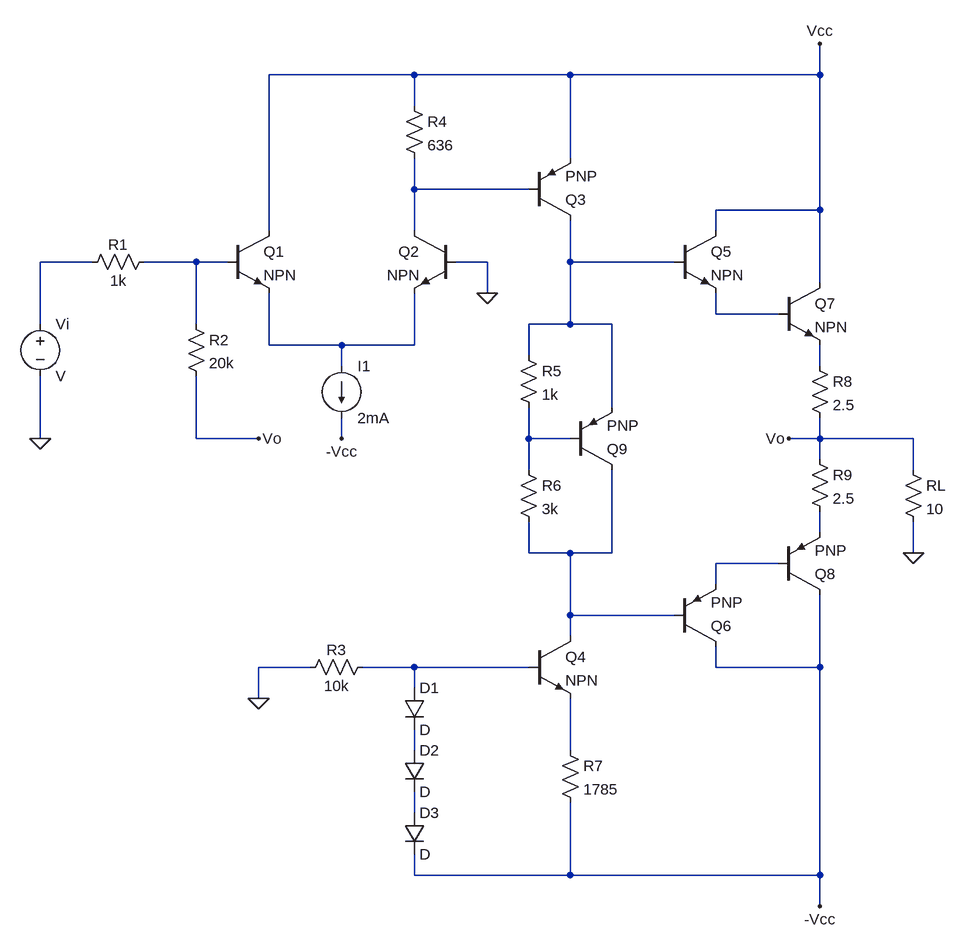
[diagram p0: schematic Ej 3-6.asc]
Ej 3-6.asc, the LTspice schematic file:
Version 4
SHEET 1 1208 1104
WIRE 384 -272 160 -272
WIRE 624 -272 384 -272
WIRE 1008 -272 1008 -320
WIRE 1008 -272 624 -272
WIRE 384 -224 384 -272
WIRE 624 -144 624 -272
WIRE 384 -96 384 -144
WIRE 560 -96 384 -96
WIRE 1008 -64 1008 -272
WIRE 1008 -64 848 -64
WIRE 160 -32 160 -272
WIRE 384 -32 384 -96
WIRE 848 -32 848 -64
WIRE -112 16 -192 16
WIRE 48 16 -32 16
WIRE 96 16 48 16
WIRE 496 16 448 16
WIRE 624 16 624 -48
WIRE 784 16 624 16
WIRE 1008 48 1008 -64
WIRE 496 64 496 16
WIRE 848 96 848 64
WIRE 944 96 848 96
WIRE -192 112 -192 16
WIRE 48 112 48 16
WIRE 624 112 624 16
WIRE 624 112 560 112
WIRE 688 112 624 112
WIRE 160 144 160 64
WIRE 272 144 160 144
WIRE 384 144 384 64
WIRE 384 144 272 144
WIRE 560 160 560 112
WIRE 272 176 272 144
WIRE 1008 176 1008 144
WIRE 688 240 688 112
WIRE -192 288 -192 192
WIRE 48 288 48 192
WIRE 144 288 48 288
WIRE 272 288 272 256
WIRE 560 288 560 240
WIRE 624 288 560 288
WIRE 1008 288 1008 256
WIRE 1008 288 960 288
WIRE 1152 288 1008 288
WIRE 1008 320 1008 288
WIRE 560 336 560 288
WIRE 1152 336 1152 288
WIRE 1008 432 1008 400
WIRE 560 464 560 416
WIRE 624 464 560 464
WIRE 688 464 688 336
WIRE 688 464 624 464
WIRE 1152 464 1152 416
WIRE 944 480 848 480
WIRE 848 512 848 480
WIRE 624 560 624 464
WIRE 784 560 624 560
WIRE 624 592 624 560
WIRE 224 640 144 640
WIRE 384 640 304 640
WIRE 560 640 384 640
WIRE 848 640 848 608
WIRE 1008 640 1008 528
WIRE 1008 640 848 640
WIRE 384 672 384 640
WIRE 144 688 144 640
WIRE 384 768 384 736
WIRE 624 768 624 688
WIRE 384 864 384 832
WIRE 384 960 384 928
WIRE 624 960 624 848
WIRE 624 960 384 960
WIRE 1008 960 1008 640
WIRE 1008 960 624 960
WIRE 1008 1008 1008 960
FLAG 1152 464 0
FLAG 496 64 0
FLAG 272 288 -Vcc
FLAG 144 288 Vo
FLAG 960 288 Vo
FLAG -192 288 0
FLAG 1008 1008 -Vcc
FLAG 1008 -320 Vcc
FLAG 144 688 0
SYMBOL res -128 32 R270
WINDOW 0 27 56 VTop 2
WINDOW 3 3 56 VBottom 2
SYMATTR InstName R1
SYMATTR Value 1k
SYMBOL res 32 96 R0
SYMATTR InstName R2
SYMATTR Value 20k
SYMBOL res 368 -240 R0
SYMATTR InstName R4
SYMATTR Value 636
SYMBOL res 992 160 R0
SYMATTR InstName R8
SYMATTR Value 2.5
SYMBOL res 992 304 R0
SYMATTR InstName R9
SYMATTR Value 2.5
SYMBOL res 1136 320 R0
SYMATTR InstName RL
SYMATTR Value 10
SYMBOL res 544 144 R0
SYMATTR InstName R5
SYMATTR Value 1k
SYMBOL res 544 320 R0
SYMATTR InstName R6
SYMATTR Value 3k
SYMBOL res 608 752 R0
SYMATTR InstName R7
SYMATTR Value 1785
SYMBOL res 208 656 R270
WINDOW 0 27 56 VTop 2
WINDOW 3 3 56 VBottom 2
SYMATTR InstName R3
SYMATTR Value 10k
SYMBOL diode 368 672 R0
SYMATTR InstName D1
SYMBOL diode 368 768 R0
SYMATTR InstName D2
SYMBOL diode 368 864 R0
SYMATTR InstName D3
SYMBOL npn 96 -32 R0
SYMATTR InstName Q1
SYMBOL npn 448 -32 M0
SYMATTR InstName Q2
SYMBOL npn 944 48 R0
SYMATTR InstName Q7
SYMBOL npn 784 -32 R0
SYMATTR InstName Q5
SYMBOL pnp 944 528 M180
SYMATTR InstName Q8
SYMBOL pnp 784 608 M180
SYMATTR InstName Q6
SYMBOL npn 560 592 R0
SYMATTR InstName Q4
SYMBOL pnp 624 336 M180
SYMATTR InstName Q9
SYMBOL pnp 560 -48 M180
SYMATTR InstName Q3
SYMBOL current 272 176 R0
SYMATTR InstName I1
SYMATTR Value 2mA
SYMBOL voltage -192 96 R0
SYMATTR InstName Vi

The netlist it stands for:
* Ej 3-6.asc
R1 N002 N003 1k
R2 N003 Vo 20k
R4 Vcc N001 636
R8 N007 Vo 2.5
R9 Vo N009 2.5
RL Vo 0 10
R5 N004 N008 1k
R6 N008 N010 3k
R7 N014 -Vcc 1785
R3 0 N012 10k
D1 N012 N013 D
D2 N013 N015 D
D3 N015 -Vcc D
Q1 Vcc N003 N006 0 NPN
Q2 N001 0 N006 0 NPN
Q7 Vcc N005 N007 0 NPN
Q5 Vcc N004 N005 0 NPN
Q8 -Vcc N011 N009 0 PNP
Q6 -Vcc N010 N011 0 PNP
Q4 N010 N012 N014 0 NPN
Q9 N010 N008 N004 0 PNP
Q3 N004 N001 Vcc 0 PNP
I1 N006 -Vcc 2mA
Vi N002 0 V
.model D D
.lib standard.dio
.model NPN NPN
.model PNP PNP
.lib standard.bjt
.backanno
.end